# EAGLE design main (EAGLE 9.6.2)
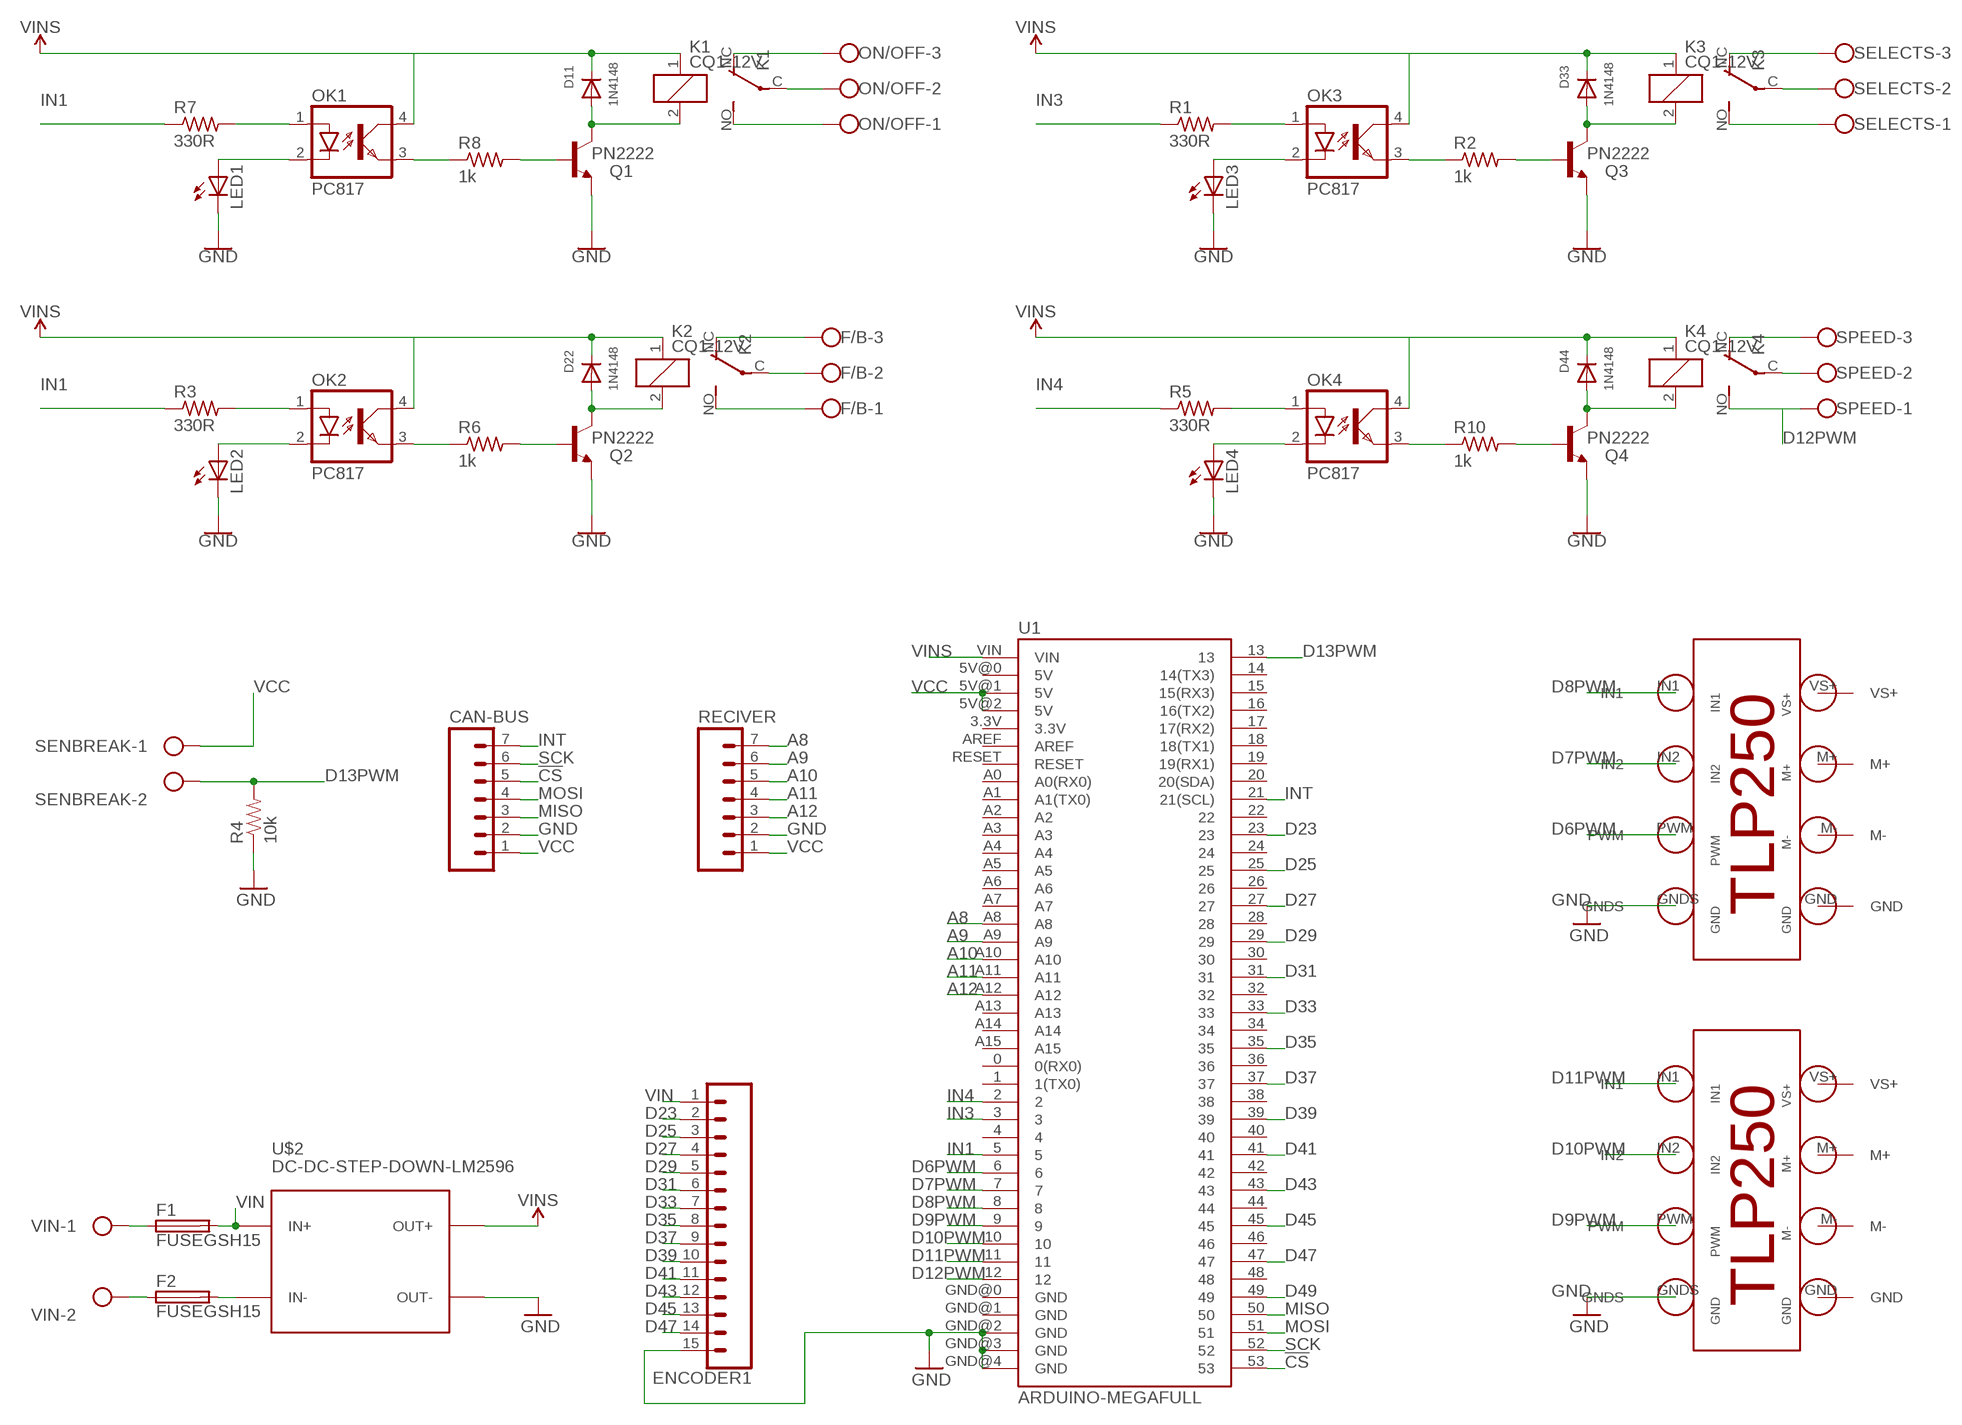
[diagram p0: schematic, sheet 1]

## Parts
CAN-BUS  M07  [1X07]
D11  1N4148  DIODEDO-1N4148  [DO-1N4148]
D22  1N4148  DIODEDO-1N4148  [DO-1N4148]
D33  1N4148  DIODEDO-1N4148  [DO-1N4148]
D44  1N4148  DIODEDO-1N4148  [DO-1N4148]
ENCODER1  CONN_15  [1X15]
F1  FUSEGSH15  [GSH15]
F2  FUSEGSH15  [GSH15]
F/B  W237-103  [W237-103]
K1  CQ1-12V  [CQ1]
K2  CQ1-12V  [CQ1]
K3  CQ1-12V  [CQ1]
K4  CQ1-12V  [CQ1]
LED1  LED3MM  [LED3MM]
LED2  LED3MM  [LED3MM]
LED3  LED3MM  [LED3MM]
LED4  LED3MM  [LED3MM]
OK1  PC817  [DIL04]
OK2  PC817  [DIL04]
OK3  PC817  [DIL04]
OK4  PC817  [DIL04]
ON/OFF  W237-103  [W237-103]
Q1  PN2222  BC447  [TO92-EBC]
Q2  PN2222  BC447  [TO92-EBC]
Q3  PN2222  BC447  [TO92-EBC]
Q4  PN2222  BC447  [TO92-EBC]
R1  330R  R-US_0204/7  [0204/7]
R2  1k  R-US_0204/7  [0204/7]
R3  330R  R-US_0204/7  [0204/7]
R4  10k  RESISTORAXIAL-0.3  [AXIAL-0.3]
R5  330R  R-US_0204/7  [0204/7]
R6  1k  R-US_0204/7  [0204/7]
R7  330R  R-US_0204/7  [0204/7]
R8  1k  R-US_0204/7  [0204/7]
R10  1k  R-US_0204/7  [0204/7]
RECIVER  M07  [1X07]
SELECTS  W237-103  [W237-103]
SENBREAK  Vcc  W237-102  [W237-102]
SPEED  W237-103  [W237-103]
U1  ARDUINO-MEGAFULL  [ARDUINO_MEGA]
U$2  DC-DC-STEP-DOWN-LM2596  [DC-DC-STEP-DOWN-LM2596]
U$3  TLP250V1  [TLP250]
U$4  TLP250V1  [TLP250]
VIN  -  W237-102  [W237-102]

## Nets
3: D33.A K3.2 Q3.C
6: D44.A K4.2 Q4.C
22: D11.A K1.2 Q1.C
!CS: CAN-BUS.5 U1.53
A8: RECIVER.7 U1.A8
A9: RECIVER.6 U1.A9
A10: RECIVER.5 U1.A10
A11: RECIVER.4 U1.A11
A12: RECIVER.3 U1.A12
D6PWM: U1.6 U$3.PWM
D7PWM: U1.7 U$3.IN2
D8PWM: U1.8 U$3.IN1
D9PWM: U1.9 U$4.PWM
D10PWM: U1.10 U$4.IN2
D11PWM: U1.11 U$4.IN1
D12PWM: K4.NO(2:S) SPEED.1 U1.12
D13PWM: R4.P$2 SENBREAK.2 U1.13
D23: ENCODER1.2 U1.23
D25: ENCODER1.3 U1.25
D27: ENCODER1.4 U1.27
D29: ENCODER1.5 U1.29
D31: ENCODER1.6 U1.31
D33: ENCODER1.7 U1.33
D35: ENCODER1.8 U1.35
D37: ENCODER1.9 U1.37
D39: ENCODER1.10 U1.39
D41: ENCODER1.11 U1.41
D43: ENCODER1.12 U1.43
D45: ENCODER1.13 U1.45
D47: ENCODER1.14 U1.47
D49: U1.49
GND: CAN-BUS.2 ENCODER1.15 LED1.K(C) LED2.K(C) LED3.K(C) LED4.K(C) Q1.E Q2.E Q3.E Q4.E R4.P$1 RECIVER.2 U1.GND@2(GND) U1.GND@3(GND) U1.GND@4(GND) U$2.OUT- U$3.GNDS U$4.GNDS
GND-: D22.A K2.2 Q2.C
IN1: R3.1 R7.1 U1.5
IN3: R1.1 U1.3
IN4: R5.1 U1.2
INS: OK2.1(A) R3.2
INSS: OK1.1(A) R7.2
INSS1: OK3.1(A) R1.2
INSS2: OK4.1(A) R5.2
INT: CAN-BUS.7 U1.21(21(SCL))
LED: LED2.A OK2.2(C)
LEDS: LED1.A OK1.2(C)
LEDS1: LED3.A OK3.2(C)
LEDS2: LED4.A OK4.2(C)
MISO: CAN-BUS.3 U1.50
MOSI: CAN-BUS.4 U1.51
N$2: K1.NO(2:S) ON/OFF.1
N$3: K1.C(2:P) ON/OFF.2
N$4: F/B.1 K2.NO(2:S)
N$5: F/B.2 K2.C(2:P)
N$6: Q3.B R2.2
N$7: OK3.3(EMIT) R2.1
N$8: K3.NO(2:S) SELECTS.1
N$9: K3.C(2:P) SELECTS.2
N$10: Q4.B R10.2
N$11: OK4.3(EMIT) R10.1
N$12: Q2.B R6.2
N$13: K4.NC(2:O) SPEED.3
N$14: K4.C(2:P) SPEED.2
N$15: K1.NC(2:O) ON/OFF.3
N$16: F/B.3 K2.NC(2:O)
N$17: K3.NC(2:O) SELECTS.3
N$20: Q1.B R8.2
N$22: OK1.3(EMIT) R8.1
N$24: F1.1 VIN.1
N$25: F2.2 U$2.IN-
N$26: F2.1 VIN.2
OTP: OK2.3(EMIT) R6.1
SCK: CAN-BUS.6 U1.52
VCC: CAN-BUS.1 D11.C D22.C D33.C D44.C K1.1 K2.1 K3.1 K4.1 OK1.4(COL) OK2.4(COL) OK3.4(COL) OK4.4(COL) RECIVER.1 SENBREAK.1 U1.5V@1(5V) U1.5V@2(5V) U$2.OUT+ ; supply symbol labelled VINS
VIN: ENCODER1.1 F1.2 U$2.IN+
VINS: U1.VIN
Unconnected: U1.0(0(RX0)) U1.1(1(TX0)) U1.3.3V U1.4 U1.5V@0(5V) U1.14(14(TX3)) U1.15(15(RX3)) U1.16(16(TX2)) U1.17(17(RX2)) U1.18(18(TX1)) U1.19(19(RX1)) U1.20(20(SDA)) U1.22 U1.24 U1.26 U1.28 U1.30 U1.32 U1.34 U1.36 U1.38 U1.40 U1.42 U1.44 U1.46 U1.48 U1.A0(A0(RX0)) U1.A1(A1(TX0)) U1.A2 U1.A3 U1.A4 U1.A5 U1.A6 U1.A7 U1.A13 U1.A14 U1.A15 U1.AREF U1.GND@0(GND) U1.GND@1(GND) U1.RESET U$3.GND U$3.M+ U$3.M- U$3.VS+ U$4.GND U$4.M+ U$4.M- U$4.VS+

## Library data of the parts
CAN-BUS RECIVER = SparkFun:M07: Header 7 Standard 7-pin 0.1" header. Use with straight break away headers (SKU : PRT-00116), right angle break away headers (PRT-00553), swiss pins (PRT-00743), machine pins (PRT-00117), and female headers (PRT-00115). NOTES ON THE VARIANTS LOCK and LOCK_LONGPADS... This footprint was designed to help hold the alignment of a through-hole component (i.e. 7-pin header) while soldering it into place. You may notice that each hole has been shifted either up or down by 0.005 of an inch from it's more standard position (which is usually a perfectly straight line). This slight alteration caused the pins (the squares in the middle) to touch the edges of the holes. Because they are alternating, it causes a "brace" to hold the header in place. 0.005 has proven to be the perfect amount of "off-center" position when using our standard breakaway headers. Although looks a little odd when you look at the bare footprint, once you have a header in there, the alteration is very hard to notice. Also, if you push a header all the way into place, it is covered up entirely on the bottom side. This idea of altering the position of holes to aid alignment will be further integrated into the Sparkfun Library for other footprints. It can help hold any component with 3 or more connection pins.
D11 D22 D33 D44 = adafruit:DIODE: Diode SMADIODE - SMA Surface Mount Package 20V 1A Schottky Diode Digikey: 641-1014-6-ND DO-1N4148 - Through Hole Small Current Diode SOD-123 20V 1 A (.5mV Vf) Schottky Diode - Digikey: MBRX120TPMSCT-ND SOD-323 10V 570mA (.38mV Vf, 3ns) Schottky Diode - Digikey: ZLLS410CT-ND SOD-523 30V 30mA Schottky Diode (RB751S-40TE61) - Digikey: RB751S-40TE61CT-ND SOT23-R/W - SOT23 Package (R = Solder Paste/Reflow Ovens, W = Hand-Soldering) BAT54Film 40V 300mA - Digikey: 497-7162-1-ND
ENCODER1 = SparkFun-Connectors:CONN_15: Multi connection point. Often used as Generic Header-pin footprint for 0.1 inch spaced/style header connections On any of the 0.1 inch spaced packages, you can populate with these: Break Away Headers - Straight <https://www.sparkfun.com/products/116> (PRT-00116) Break Away Male Headers - Right Angle <https://www.sparkfun.com/products/553> (PRT-00553) Female Headers <https://www.sparkfun.com/products/115> (PRT-00115) Break Away Headers - Machine Pin <https://www.sparkfun.com/products/117> (PRT-00117) Break Away Female Headers - Swiss Machine Pin <https://www.sparkfun.com/products/743> (PRT-00743) For SCREWTERMINALS and SPRING TERMINALS visit here: Screw Terimnals on SparkFun.com <https://www.sparkfun.com/search/results?term=Screw+Terminals> (5mm/3.5mm/2.54mm spacing) This device is also useful as a general connection point to wire up your design to another part of your project. Our various solder wires solder well into these plated through hole pads. Hook-Up Wire - Assortment (Stranded, 22 AWG) <https://www.sparkfun.com/products/11375> (PRT-11375) Hook-Up Wire - Assortment (Solid Core, 22 AWG) <https://www.sparkfun.com/products/11367> (PRT-11367) View the entire wire category on our website here <https://www.sparkfun.com/categories/141> Special notes: Molex polarized connector foot print use with SKU : PRT-08231 with associated crimp pins and housings. 1MM SMD Version SKU: PRT-10208 NOTES ON THE VARIANTS LOCK and LOCK_LONGPADS... This footprint was designed to help hold the alignment of a through-hole component (i.e. 6-pin header) while soldering it into place. You may notice that each hole has been shifted either up or down by 0.005 of an inch from it's more standard position (which is a perfectly straight line). This slight alteration caused the pins (the squares in the middle) to touch the edges of the holes. Because they are alternating, it causes a "brace" to hold the component in place. 0.005 has proven to be the perfect amount of "off-center" position when using our standard breakaway headers. Although looks a little odd when you look at the bare footprint, once you have a header in there, the alteration is very hard to notice. Also,if you push a header all the way into place, it is covered up entirely on the bottom side.
F1 F2 = fuse:FUSE: Fuse; OC_FARNELL: unknown; OC_NEWARK: unknown
F/B ON/OFF SELECTS SPEED = con-wago-500:W237-103: WAGO SCREW CLAMP; MPN: 237-103; OC_FARNELL: unknown; OC_NEWARK: 18M7116
K1-K4 = relay5vdc:CQ1-12V: AUTOMOTIVE QUIET RELAY NAiS Source: http://www.mew-europe.com/.. en_ds_61208_0000.pdf; OC_FARNELL: unknown; OC_NEWARK: unknown
LED1-LED4 = adafruit:LED: LED OSRAM: - CHIPLED LG R971, LG N971, LY N971, LG Q971, LY Q971, LO R971, LY R971 LH N974, LH R974 LS Q976, LO Q976, LY Q976 LO Q996 - Hyper CHIPLED LW Q18S LB Q993, LB Q99A, LB R99A - SideLED LS A670, LO A670, LY A670, LG A670, LP A670 LB A673, LV A673, LT A673, LW A673 LH A674 LY A675 LS A676, LA A676, LO A676, LY A676, LW A676 LS A679, LY A679, LG A679 - Hyper Micro SIDELED® LS Y876, LA Y876, LO Y876, LY Y876 LT Y87S - SmartLED LW L88C, LW L88S LB L89C, LB L89S, LG L890 LS L89K, LO L89K, LY L89K LS L896, LA L896, LO L896, LY L896 - TOPLED LS T670, LO T670, LY T670, LG T670, LP T670 LSG T670, LSP T670, LSY T670, LOP T670, LYG T670 LG T671, LOG T671, LSG T671 LB T673, LV T673, LT T673, LW T673 LH T674 LS T676, LA T676, LO T676, LY T676, LB T676, LH T676, LSB T676, LW T676 LB T67C, LV T67C, LT T67C, LS T67K, LO T67K, LY T67K, LW E67C LS E67B, LA E67B, LO E67B, LY E67B, LB E67C, LV E67C, LT E67C LW T67C LS T679, LY T679, LG T679 LS T770, LO T770, LY T770, LG T770, LP T770 LB T773, LV T773, LT T773, LW T773 LH T774 LS E675, LA E675, LY E675, LS T675 LS T776, LA T776, LO T776, LY T776, LB T776 LHGB T686 LT T68C, LB T68C - Hyper Mini TOPLED® LB M676 - Mini TOPLED Santana® LG M470 LS M47K, LO M47K, LY M47K Source: http://www.osram.convergy.de/
OK1-OK4 = optocoupler:PC817: SHARP OPTO COUPLER; MPN: PC817X4J000F; OC_FARNELL: 9707727; OC_NEWARK: 97K7059
Q1-Q4 = transistor-npn:BC447*: NPN Transistor
R1-R3 R5-R8 R10 = adafruit:R-US_: RESISTOR, American symbol
R4 = SparkFun-Passives:RESISTOR: Resistor Basic schematic elements and footprints for 0603, 1206, and PTH resistors.
SENBREAK VIN = con-wago-500:W237-102: WAGO SCREW CLAMP; MPN: 237-102; OC_FARNELL: unknown; OC_NEWARK: 70K9898
U1 = SparkFun-Boards:ARDUINO-MEGA: Arduino Mega board footprint
U$2 = diy-modules:DC-DC-STEP-DOWN-LM2596: DC/DC Step-Down Regulator based on LM2596-ADJ chip LM2596 datasheet available here: http://www.ti.com/lit/ds/symlink/lm2596.pdf Click here to find device on ebay.com <http://www.ebay.com/sch/lm2596+power+regulator>
U$3 U$4 = TLP250:TLP250V1

## Board
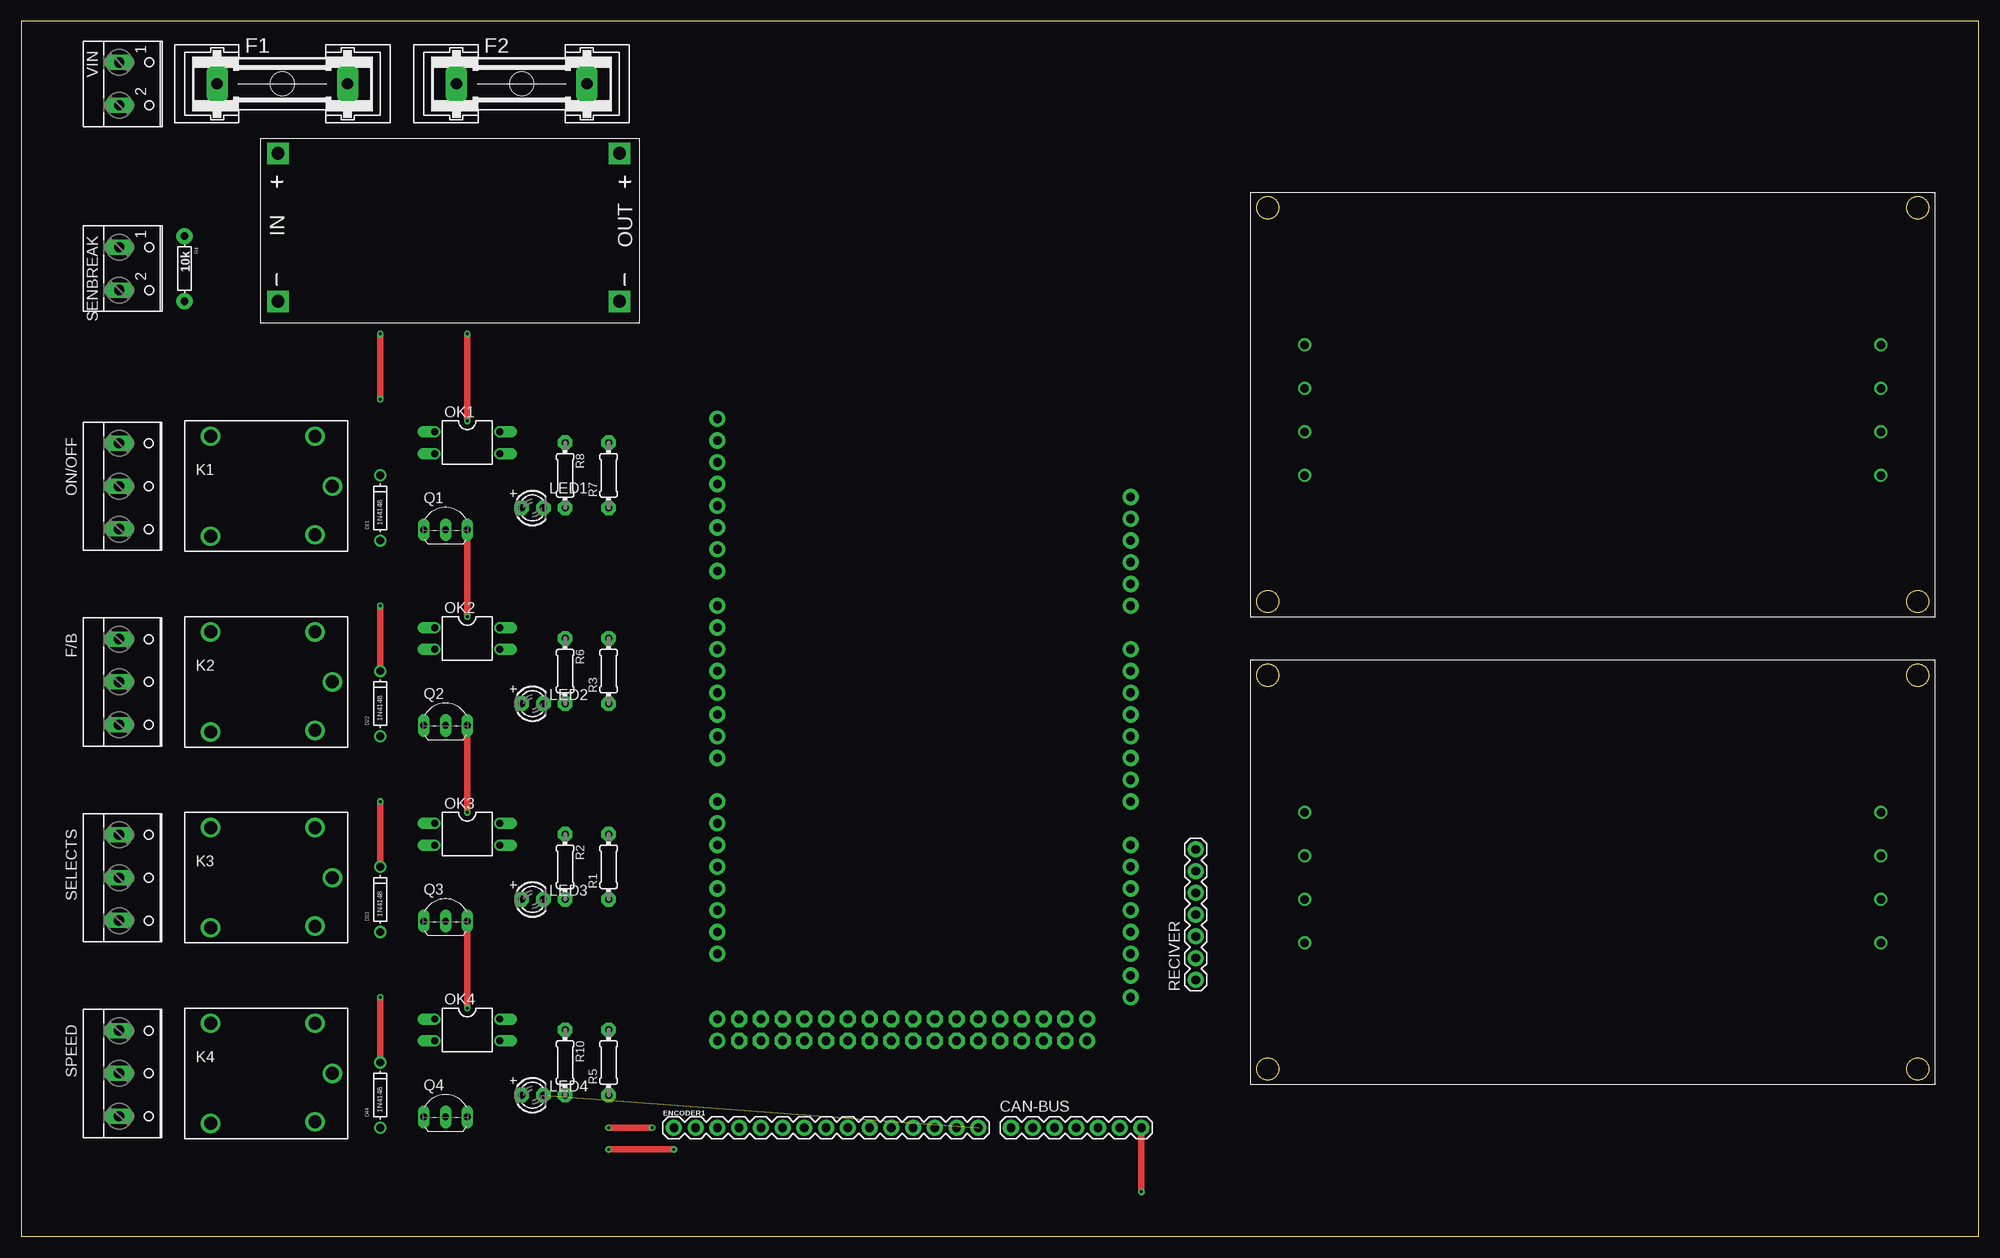
[diagram p1: board, top side]
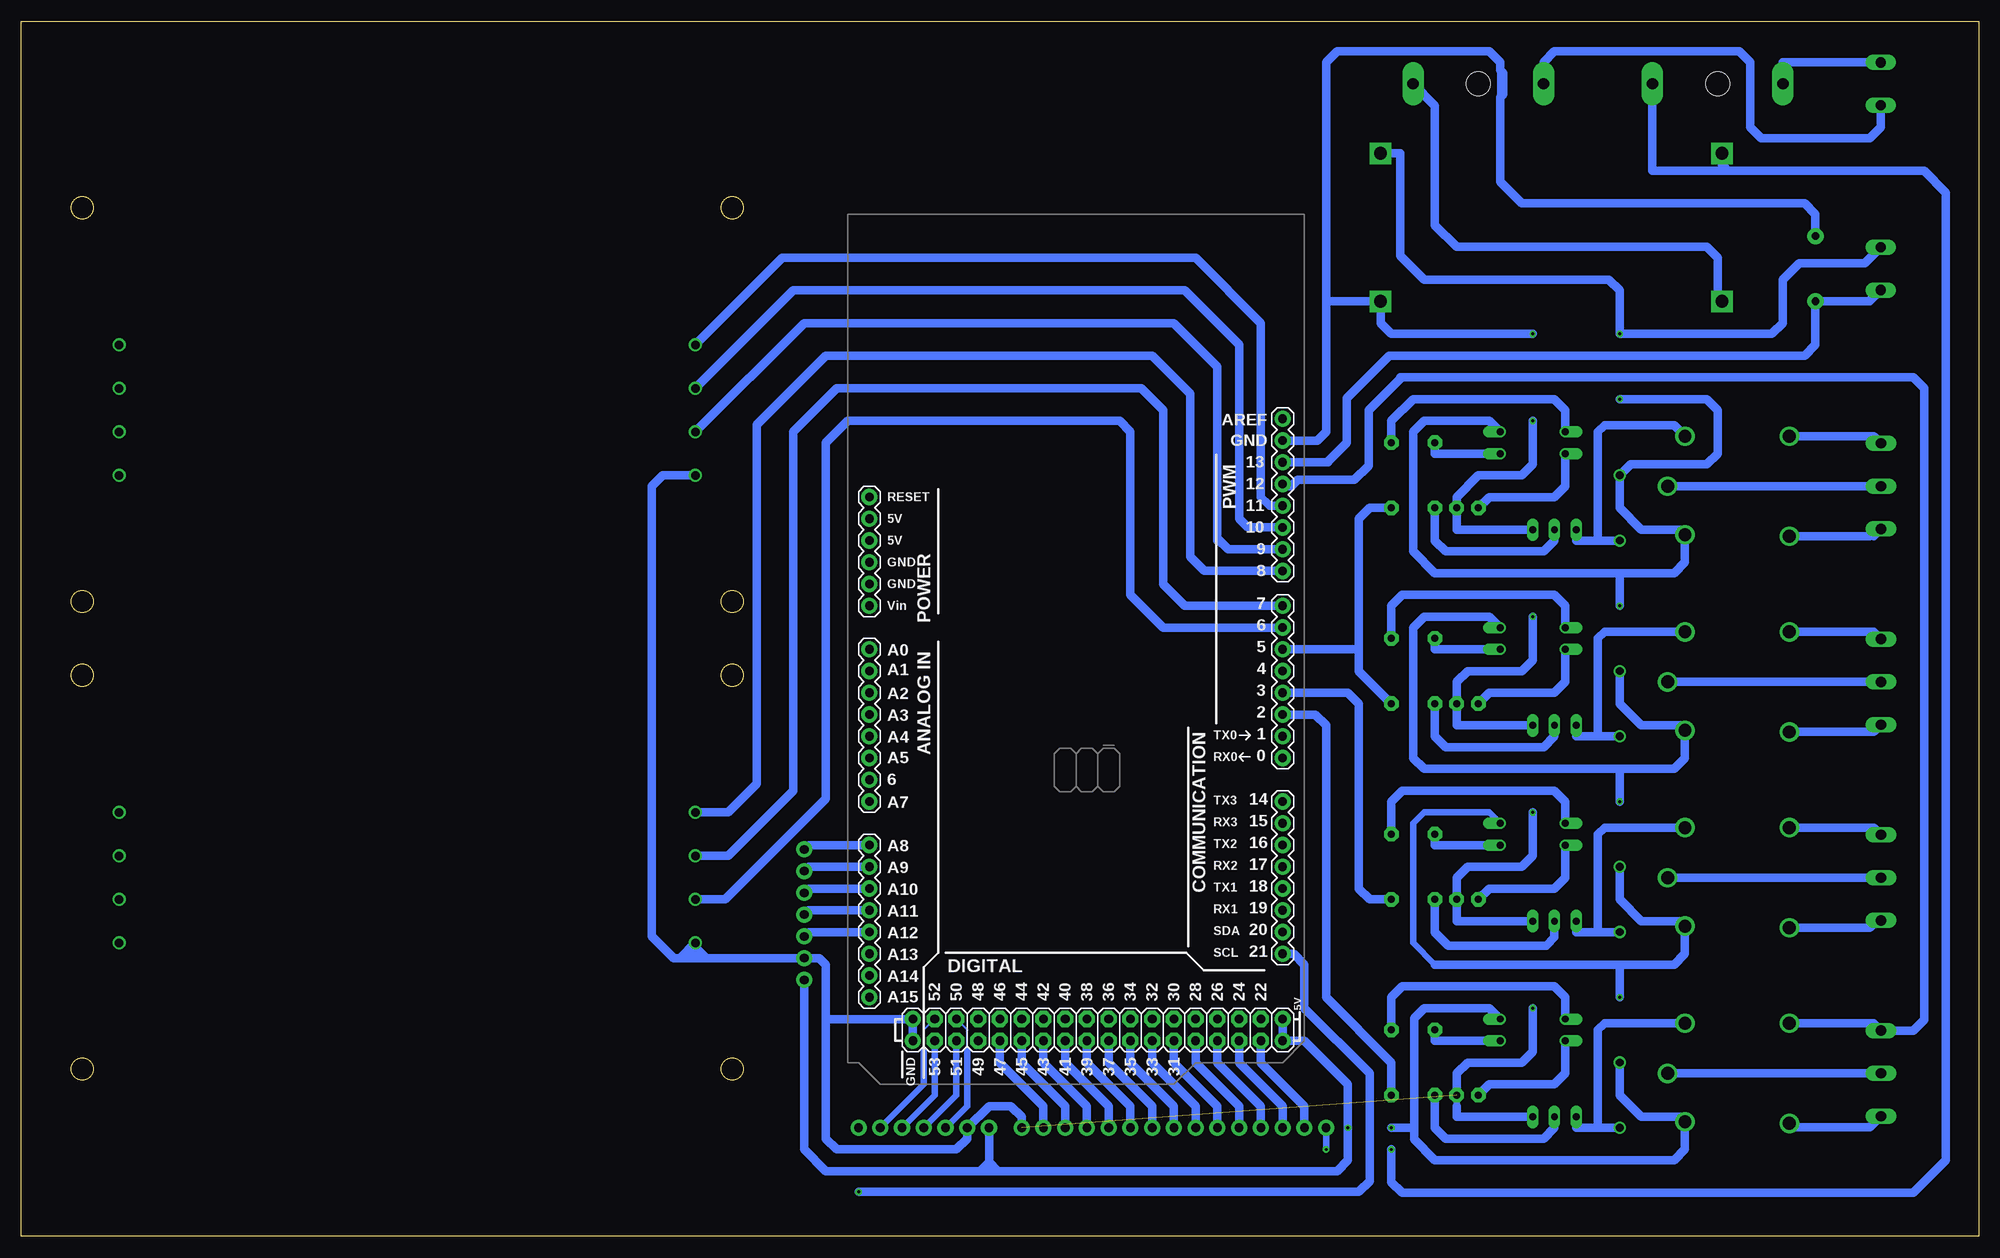
[diagram p2: board, bottom side, seen from below]

Size 228.58 x 141.91 mm. Coordinates in mm from the lower left corner, seen from the top.
Outline: 0,0 228.58,0 228.58,141.91 0,141.91 0,0
Copper layers (1*16): Top 0.035mm / dielectric 1.5mm / Bottom 0.035mm
Design rules "default": minimum track width 6mil, minimum drill 0.35mm, track to track 6mil, track to pad 6mil, pad to pad 6mil, via to via 6mil, smd to smd 6mil, copper to edge 40mil, drill to drill 6mil, minimum pad ring 10mil, minimum via ring 8mil, stop-mask expansion 4mil, vias tented up to drill 0mil, thermal gap 10mil

### Footprints (pad centres in the part's own frame; a part is rotated, then mirrored left to right if it is on the bottom)
1X07 = drill 1.016 pad 1.88: 1 0,0; 2 2.54,0; 3 5.08,0; 4 7.62,0; 5 10.16,0; 6 12.7,0; 7 15.24,0
DO-1N4148 = drill 0.9: A -3.81,0; C 3.81,0
1X15 = drill 1.016 pad 1.88: 1 0,0; 2 2.54,0; 3 5.08,0; 4 7.62,0; 5 10.16,0; 6 12.7,0; 7 15.24,0; 8 17.78,0; 9 20.32,0; 10 22.86,0; 11 25.4,0; 12 27.94,0; 13 30.48,0; 14 33.02,0; 15 35.56,0
GSH15 = drill 1.321 pad 2.54 long: 1 -7.62,0; 2 7.62,0 | hole 2.794: 0,0
W237-103 = drill 1.194 long: 1 -5,-1.29; 2 0,-1.29; 3 5,-1.29
CQ1 = drill 1.5: 1 5.08,-5.66; 2 5.08,5.842; C 7.112,0; NC -7.112,-5.842; NO -7.112,5.842
LED3MM = drill 0.813 pad 1.676 octagon: A -1.27,0; K 1.27,0
DIL04 = drill 0.813 offset: 1 -1.27,-3.81; 2 1.27,-3.81; 3 1.27,3.81; 4 -1.27,3.81
TO92-EBC = drill 0.813 long: B 0,-1.27; C -2.54,-1.27; E 2.54,-1.27
0204/7 = drill 0.813 pad 1.676 octagon: 1 -3.81,0; 2 3.81,0
AXIAL-0.3 = drill 0.9 pad 1.88: P$1 -3.81,0; P$2 3.81,0
W237-102 = drill 1.194 long: 1 -2.5,-1.27; 2 2.5,-1.27
ARDUINO_MEGA = drill 1.016 pad 1.88: 0 63.5,50.8; 1 60.96,50.8; 2 58.42,50.8; 3 55.88,50.8; 3.3V 35.56,2.54; 4 53.34,50.8; 5 50.8,50.8; 5V@0 38.1,2.54; 5V@1 93.98,50.8; 5V@2 96.52,50.8; 6 48.26,50.8; 7 45.72,50.8; 8 41.656,50.8; 9 39.116,50.8; 10 36.576,50.8; 11 34.036,50.8; 12 31.496,50.8; 13 28.956,50.8; 14 68.58,50.8; 15 71.12,50.8; 16 73.66,50.8; 17 76.2,50.8; 18 78.74,50.8; 19 81.28,50.8; 20 83.82,50.8; 21 86.36,50.8; A0 50.8,2.54; A1 53.34,2.54; A2 55.88,2.54; A3 58.42,2.54; A4 60.96,2.54; A5 63.5,2.54; A6 66.04,2.54; A7 68.58,2.54; A8 73.66,2.54; A9 76.2,2.54; A10 78.74,2.54; A11 81.28,2.54; A12 83.82,2.54; A13 86.36,2.54; A14 88.9,2.54; A15 91.44,2.54; AREF 23.876,50.8; GND@0 40.64,2.54; GND@1 43.18,2.54; GND@2 93.98,7.62; GND@3 96.52,7.62; GND@4 26.416,50.8; RESET 33.02,2.54; VIN 45.72,2.54 | drill 1.016 pad 1.88 octagon: 22 93.98,48.26; 23 96.52,48.26; 24 93.98,45.72; 25 96.52,45.72; 26 93.98,43.18; 27 96.52,43.18; 28 93.98,40.64; 29 96.52,40.64; 30 93.98,38.1; 31 96.52,38.1; 32 93.98,35.56; 33 96.52,35.56; 34 93.98,33.02; 35 96.52,33.02; 36 93.98,30.48; 37 96.52,30.48; 38 93.98,27.94; 39 96.52,27.94; 40 93.98,25.4; 41 96.52,25.4; 42 93.98,22.86; 43 96.52,22.86; 44 93.98,20.32; 45 96.52,20.32; 46 93.98,17.78; 47 96.52,17.78; 48 93.98,15.24; 49 96.52,15.24; 50 93.98,12.7; 51 96.52,12.7; 52 93.98,10.16; 53 96.52,10.16
DC-DC-STEP-DOWN-LM2596 = drill 1.5 pad 2.5 square: IN+ -22.098,8.382; IN- -22.098,-8.89; OUT+ 17.78,8.382; OUT- 17.78,-8.89
TLP250 = drill 1: GND 10.16,33.02; GNDS 10.16,-34.29; IN1 -5.08,-34.29; IN2 0,-34.29; M+ 0,33.02; M- 5.08,33.02; PWM 5.08,-34.29; VS+ -5.08,33.02

### Placement (x,y rotation side)
CAN-BUS  115.57,12.7 0 top
D11  41.91,85.09 90 top
D22  41.91,62.23 90 top
D33  41.91,39.37 90 top
D44  41.91,16.51 90 top
ENCODER1  76.2,12.7 0 top
F1  30.48,134.62 0 top
F2  58.42,134.62 0 top
F/B  12.7,64.77 270 top
K1  29.21,87.63 0 top
K2  29.21,64.77 0 top
K3  29.21,41.91 0 top
K4  29.21,19.05 0 top
LED1  59.69,85.09 0 top
LED2  59.69,62.23 0 top
LED3  59.69,39.37 0 top
LED4  59.69,16.51 0 top
OK1  52.07,92.71 270 top
OK2  52.07,69.85 270 top
OK3  52.07,46.99 270 top
OK4  52.07,24.13 270 top
ON/OFF  12.7,87.63 270 top
Q1  49.53,83.82 0 top
Q2  49.53,60.96 0 top
Q3  49.53,38.1 0 top
Q4  49.53,15.24 0 top
R1  68.58,43.18 90 top
R2  63.5,43.18 270 top
R3  68.58,66.04 90 top
R4  19.05,113.03 270 top
R5  68.58,20.32 90 top
R6  63.5,66.04 270 top
R7  68.58,88.9 90 top
R8  63.5,88.9 270 top
R10  63.5,20.32 270 top
RECIVER  137.16,29.97 90 top
SELECTS  12.7,41.91 270 top
SENBREAK  12.7,113.03 270 top
SPEED  12.7,19.05 270 top
U1  132.08,119.38 270 bottom
U$2  52.07,118.11 0 top
U$3  184.15,44.45 270 top
U$4  184.15,99.06 270 top
VIN  12.7,134.62 270 top

### Tracks (layer width: path | path; a pad name or v marks a point on that pad's centre or on a via)
3
  Bottom 0.762: Q3.C 46.99,35.56 44.45,35.56 D33.A
  Bottom 1.016: D33.A 46.99,35.56 | 44.45,35.56 44.45,46.99 43.69,47.75 K3.2
6
  Bottom 0.762: Q4.C 46.99,12.7 44.45,12.7 D44.A
  Bottom 1.016: D44.A 46.99,12.7 | 44.45,12.7 44.45,24.13 43.69,24.89 K4.2
22
  Bottom 1.016: D11.A 44.45,81.28 | 44.45,81.28 46.99,81.28 Q1.C | K1.2 35.56,94.74 43.69,94.74 44.45,93.98 44.45,81.28
!CS
  Bottom 0.762: CAN-BUS.5 121.92,16.51 U1.53
A8
  Bottom 1.016: U1.A8 136.65,45.72 RECIVER.7
A9
  Bottom 1.016: U1.A9 136.65,43.18 RECIVER.6
A10
  Bottom 1.016: RECIVER.5 136.65,40.64 U1.A10
A11
  Bottom 0.762: 136.65,38.1 RECIVER.4
  Bottom 1.016: U1.A11 136.65,38.1
A12
  Bottom 0.762: 136.65,35.56 RECIVER.3
  Bottom 1.016: U1.A12 136.65,35.56
D6PWM
  Bottom 1.016: U$3.PWM 146.35,39.37 134.62,51.1 134.62,92.71 132.08,95.25 100.33,95.25 99.06,93.98 99.06,74.93 95.25,71.12 U1.6
D7PWM
  Bottom 1.016: U1.7 92.71,73.66 95.25,76.2 95.25,96.52 97.79,99.06 133.35,99.06 138.43,93.98 138.43,52.07 146.05,44.45 U$3.IN2
D8PWM
  Bottom 1.016: U1.8 90.42,77.72 92.08,79.38 92.08,98.42 96.52,102.87 134.62,102.87 142.69,94.81 142.69,52.9 146.05,49.53 U$3.IN1
D9PWM
  Bottom 0.762: 87.63,80.26 87.88,80.26 88.9,81.28 88.9,101.6
  Bottom 1.016: U1.9 87.63,80.26 88.65,81.28 | 88.65,81.28 88.9,81.28 | 88.65,81.28 88.9,81.53 88.9,101.6 93.98,106.68 137.16,106.68 U$4.PWM
D10PWM
  Bottom 1.016: U$4.IN2 138.43,110.49 92.71,110.49 86.36,104.14 86.36,83.82 85.34,82.8 U1.10
D11PWM
  Bottom 1.016: U1.11 82.8,85.34 83.82,86.36 83.82,106.68 91.44,114.3 139.7,114.3 U$4.IN1
D12PWM
  Bottom 0.762: 71.25,96.52 71.25,96.65 67.56,100.33 67.31,100.33
  Bottom 1.016: K4.NO 12.25,24.89 SPEED.1 7.62,24.05 6.35,25.32 6.35,99.06 7.62,100.33 67.31,100.33 | 67.56,100.33 67.56,100.2 71.25,96.52 71.25,90.04 72.9,88.39 79.5,88.39 80.26,87.63 81.28,87.63 U1.12
D13PWM
  Bottom 0.762: 73.79,92.71 73.79,92.58 75.95,90.42 | 12.7,109.26 SENBREAK.2
  Bottom 1.016: U1.13 75.95,90.42 75.95,90.55 73.79,92.71 73.79,97.92 68.83,102.87 20.32,102.87 19.05,104.14 R4.P$2 12.74,109.22 12.7,109.26 SENBREAK.2
D23
  Bottom 1.016: ENCODER1.2 78.74,15.24 83.82,20.32 U1.23
D25
  Bottom 1.016: ENCODER1.3 81.28,15.24 86.36,20.32 U1.25
D27
  Bottom 1.016: ENCODER1.4 83.82,15.24 88.9,20.32 U1.27
D29
  Bottom 1.016: U1.29 91.44,20.32 86.36,15.24 ENCODER1.5
D31
  Bottom 1.016: ENCODER1.6 88.9,15.24 93.98,20.32 U1.31
D33
  Bottom 1.016: ENCODER1.7 91.44,15.24 96.52,20.32 U1.33
D35
  Bottom 1.016: ENCODER1.8 93.98,15.24 99.06,20.32 U1.35
D37
  Bottom 1.016: ENCODER1.9 96.52,15.24 101.6,20.32 U1.37
D39
  Bottom 1.016: ENCODER1.10 99.06,15.24 104.14,20.32 U1.39
D41
  Bottom 1.016: ENCODER1.11 101.6,15.24 106.68,20.32 U1.41
D43
  Bottom 1.016: ENCODER1.12 104.14,15.24 109.22,20.32 U1.43
D45
  Bottom 1.016: ENCODER1.13 106.68,15.24 111.76,20.32 U1.45
D47
  Bottom 1.016: ENCODER1.14 109.22,15.24 114.3,20.32 U1.47
GND  (via drill 0.35)  (1 unrouted)
  Top 0.762: v52.07,26.67 Q3.E | v52.07,49.53 Q2.E | v52.07,72.39 Q1.E | v52.07,105.41 v52.07,95.25
  Bottom 0.762: U$3.GNDS 149.86,33.02 149.35,32.51 | 149.35,32.51 148.59,32.51 | 149.35,32.51 149.86,32.51 | 60.96,82.55 LED1.K 60.96,86.36 | 60.96,15.24 LED4.K 60.96,17.78 | 55.88,123.19 55.88,135.89 | 55.88,137.16 55.88,136.03 55.81,135.96
  Bottom 1.016: U1.GND@3 U1.GND@2 134.62,25.4 | 134.62,25.4 134.62,31.75 135.38,32.51 RECIVER.2 148.59,32.51 | 148.59,32.51 149.86,32.51 | 149.86,32.51 151.64,32.51 | 149.86,32.51 U$3.GNDS | 148.59,32.51 149.86,33.78 U$3.GNDS | U$3.GNDS 151.64,32.51 | 151.64,32.51 152.4,32.51 154.94,35.05 154.94,87.63 153.67,88.9 U$4.GNDS | 134.62,25.4 134.62,11.43 133.35,10.16 119.38,10.16 118.11,11.43 CAN-BUS.2 115.57,15.24 113.03,15.24 111.76,13.97 ENCODER1.15 | v52.07,26.67 52.07,21.59 53.34,20.32 59.69,20.32 60.96,19.05 LED4.K | Q4.E 60.96,13.97 60.96,15.24 | Q3.E 60.96,36.83 LED3.K 60.96,41.91 59.69,43.18 53.34,43.18 52.07,44.45 v52.07,49.53 | Q2.E 60.96,59.69 LED2.K 60.96,64.77 59.69,66.04 53.34,66.04 52.07,67.31 v52.07,72.39 | Q1.E 60.96,82.55 60.96,86.36 58.42,88.9 53.34,88.9 52.07,90.17 v52.07,95.25 | R4.P$1 19.05,119.38 20.32,120.65 53.34,120.65 55.88,123.19 55.88,133.03 55.5,133.41 55.5,135.83 55.88,136.21 55.88,137.16 57.15,138.43 74.93,138.43 76.2,137.16 76.2,109.22 | 76.2,109.22 76.2,95.25 76.2,93.98 77.22,92.96 U1.GND@4 | v52.07,105.41 68.58,105.41 69.85,106.68 U$2.OUT- 76.2,109.22
GND-
  Bottom 0.762: 46.99,58.42 Q2.C
  Bottom 1.016: D22.A 44.45,58.42 | 44.45,58.42 46.99,58.42 | K2.2 43.69,70.61 44.45,69.85 44.45,58.42
IN1
  Bottom 1.016: R7.1 71.12,85.09 72.39,83.82 72.39,69.85 72.39,68.58 | 73.66,68.58 74.93,68.58 | 74.93,68.58 76.2,68.58 U1.5 | R3.1 72.39,66.04 72.39,68.58 | 72.39,68.58 74.93,68.58
IN3
  Bottom 1.016: R1.1 71.12,39.37 72.39,40.64 72.39,62.23 73.66,63.5 U1.3
IN4
  Bottom 1.016: R5.1 68.58,20.32 76.2,27.94 76.2,59.69 77.47,60.96 U1.2
INS
  Bottom 1.016: OK2.1 48.26,73.66 49.53,74.93 67.31,74.93 68.58,73.66 R3.2
INSS
  Bottom 1.016: OK1.1 48.26,96.52 49.53,97.79 66.04,97.79 68.58,95.25 R7.2
INSS1
  Bottom 1.016: R1.2 68.58,50.8 67.31,52.07 49.53,52.07 48.26,50.8 OK3.1
INSS2
  Bottom 1.016: R5.2 68.58,27.94 67.31,29.21 49.53,29.21 48.26,27.94 OK4.1
INT  (via drill 0.35)
  Top 0.762: CAN-BUS.7 v130.81,5.2
  Bottom 0.762: v130.81,5.21 v130.81,5.2
  Bottom 1.016: v130.81,5.21 72.39,5.21 71.12,6.48 71.12,19.05 78.74,26.67 78.74,31.75 80.01,33.02 U1.21
LED
  Bottom 1.016: OK2.2 48.26,64.77 49.53,63.5 57.15,63.5 LED2.A
LEDS
  Bottom 1.016: LED1.A 57.15,86.36 49.53,86.36 48.26,87.63 OK1.2
LEDS1
  Bottom 1.016: OK3.2 48.26,41.91 49.53,40.64 57.15,40.64 LED3.A
LEDS2
  Bottom 1.016: OK4.2 48.26,19.05 49.53,17.78 57.15,17.78 LED4.A
MISO
  Bottom 0.254: U1.50 118.11,24.13 118.11,21.59
  Bottom 0.762: CAN-BUS.3 118.11,15.24 118.11,21.59
MOSI
  Bottom 0.762: U1.51 119.38,16.51 CAN-BUS.4
N$2
  Bottom 1.016: ON/OFF.1 12.25,93.47 K1.NO
N$3
  Bottom 1.016: ON/OFF.2 K1.C
N$4
  Bottom 1.016: F/B.1 12.25,70.61 K2.NO
N$5
  Bottom 0.762: 36.83,64.77 K2.C
  Bottom 1.016: F/B.2 K2.C
N$6
  Bottom 0.762: R2.2 63.5,36.2
  Bottom 1.016: Q3.B 49.53,34.92 50.48,33.97 61.28,33.97 61.91,33.97 63.5,35.56 R2.2
N$7
  Bottom 1.016: OK3.3 63.5,45.72 R2.1
N$8
  Bottom 1.016: SELECTS.1 12.25,47.75 K3.NO
N$9
  Bottom 1.016: SELECTS.2 K3.C
N$10
  Bottom 1.016: Q4.B 49.53,12.7 50.8,11.43 62.23,11.43 63.5,12.7 R10.2
N$11
  Bottom 1.016: OK4.3 63.5,22.86 R10.1
N$12
  Bottom 1.016: Q2.B 49.53,58.42 50.8,57.15 62.23,57.15 63.5,58.42 R6.2
N$13
  Bottom 1.016: SPEED.3 12.7,12.76 21.65,12.76 K4.NC
N$14
  Bottom 1.016: SPEED.2 K4.C
N$15
  Bottom 0.762: 12.25,81.79 12.7,81.79
  Bottom 1.016: ON/OFF.3 12.25,81.79 | 12.7,81.79 K1.NC
N$16
  Bottom 1.016: F/B.3 12.25,58.93 12.7,58.93 K2.NC
N$17
  Bottom 1.016: SELECTS.3 11.86,36.91 12.7,36.07 K3.NC
N$20
  Bottom 1.016: R8.2 63.5,81.28 62.23,80.01 50.8,80.01 49.53,81.28 Q1.B
N$22
  Bottom 1.016: R8.1 63.5,91.44 OK1.3
N$24
  Bottom 0.762: 22.86,137.12 F1.1
  Bottom 1.016: VIN.1 22.86,137.12
N$25
  Bottom 1.016: U$2.IN- 30.48,109.73 30.48,114.3 31.75,115.57 60.96,115.57 63.5,118.11 63.5,132.08 F2.2
N$26
  Bottom 1.016: F2.1 50.8,137.16 49.53,138.43 27.94,138.43 26.67,137.16 26.67,129.54 25.4,128.27 12.7,128.27 11.43,129.54 VIN.2
OTP
  Bottom 1.016: OK2.3 63.5,68.58 R6.1
SCK
  Bottom 0.254: U1.52 123.19,24.13 123.19,21.59
  Bottom 0.762: CAN-BUS.6 123.19,17.78 123.19,21.59
VCC  (via drill 0.35)
  Top 0.762: v41.91,105.41 v41.91,97.79 | v68.58,12.7 v73.66,12.7 | v41.91,27.94 D44.C | v41.91,73.66 D22.C | v41.91,50.8 D33.C
  Bottom 0.762: 134.62,7.62 116.84,7.62 | 116.84,7.62 115.57,7.62 | CAN-BUS.1 115.57,8.89 | 115.57,8.89 115.57,7.62 | 115.57,7.62 114.3,7.62 | 114.3,7.62 74.93,7.62 | 73.66,8.89 v73.66,12.7 73.66,17.78 | 65.94,11.33 65.94,12.7 65.94,25.5 | OK3.4 57.15,49.53 64.77,49.53 66.04,48.26 66.04,34.29 63.5,31.75 | 34.29,10.16 34.29,13.97 | 64.77,54.61 41.91,54.61 35.56,54.61 | 41.91,17.78 D44.C | 115.57,8.89 116.84,7.62 | 114.3,7.62 115.57,8.89
  Bottom 1.016: RECIVER.1 137.16,10.16 134.62,7.62 115.57,7.62 | 115.57,7.62 74.93,7.62 73.66,8.89 73.66,17.78 78.74,22.86 U1.5V@2 U1.5V@1 | 115.57,7.62 CAN-BUS.1 | OK4.4 57.15,26.67 64.77,26.67 65.94,25.5 65.94,11.33 63.5,8.89 35.56,8.89 34.29,10.16 K4.1 34.87,13.97 39.37,13.97 41.91,16.51 D44.C | 65.94,12.7 v68.58,12.7 | 41.91,31.75 35.56,31.75 34.29,33.02 K3.1 34.87,36.83 39.37,36.83 41.91,39.37 D33.C | 41.91,31.75 63.5,31.75 | v41.91,27.94 41.91,31.75 | 41.91,54.61 v41.91,50.8 | OK2.4 57.15,72.39 64.77,72.39 66.04,71.12 66.04,55.88 64.77,54.61 35.56,54.61 34.29,55.88 K2.1 34.87,59.69 39.37,59.69 41.91,62.23 D22.C | 41.91,77.47 35.56,77.47 34.29,78.74 K1.1 34.87,82.55 39.37,82.55 41.91,85.09 D11.C 40.64,90.17 31.75,90.17 30.48,91.44 30.48,96.52 31.75,97.79 v41.91,97.79 | 41.91,77.47 63.5,77.47 66.04,80.01 66.04,93.98 64.77,95.25 57.15,95.25 OK1.4 | SENBREAK.1 13.29,113.67 20.95,113.67 22.86,111.76 22.86,106.68 24.13,105.41 v41.91,105.41 41.91,110.49 43.18,111.76 64.77,111.76 67.56,114.55 67.56,126.49 U$2.OUT+ | v41.91,73.66 41.91,77.47
VIN  (via drill 0.35)
  Top 0.762: v76.2,10.16 v68.58,10.16
  Bottom 0.762: 38.1,124.46 30.48,124.46 | 29.21,124.46 30.48,124.46 | 29.84,125.09 30.48,124.46 | v76.2,10.16 ENCODER1.1
  Bottom 1.016: F1.2 38.1,124.46 29.21,124.46 | 29.21,124.46 6.35,124.46 3.81,121.92 3.81,8.89 7.62,5.08 67.31,5.08 68.58,6.35 v68.58,10.16 | U$2.IN+ 29.97,125.22 29.84,125.09 29.21,124.46